# EAGLE design masterBoard (EAGLE 7.2.0)
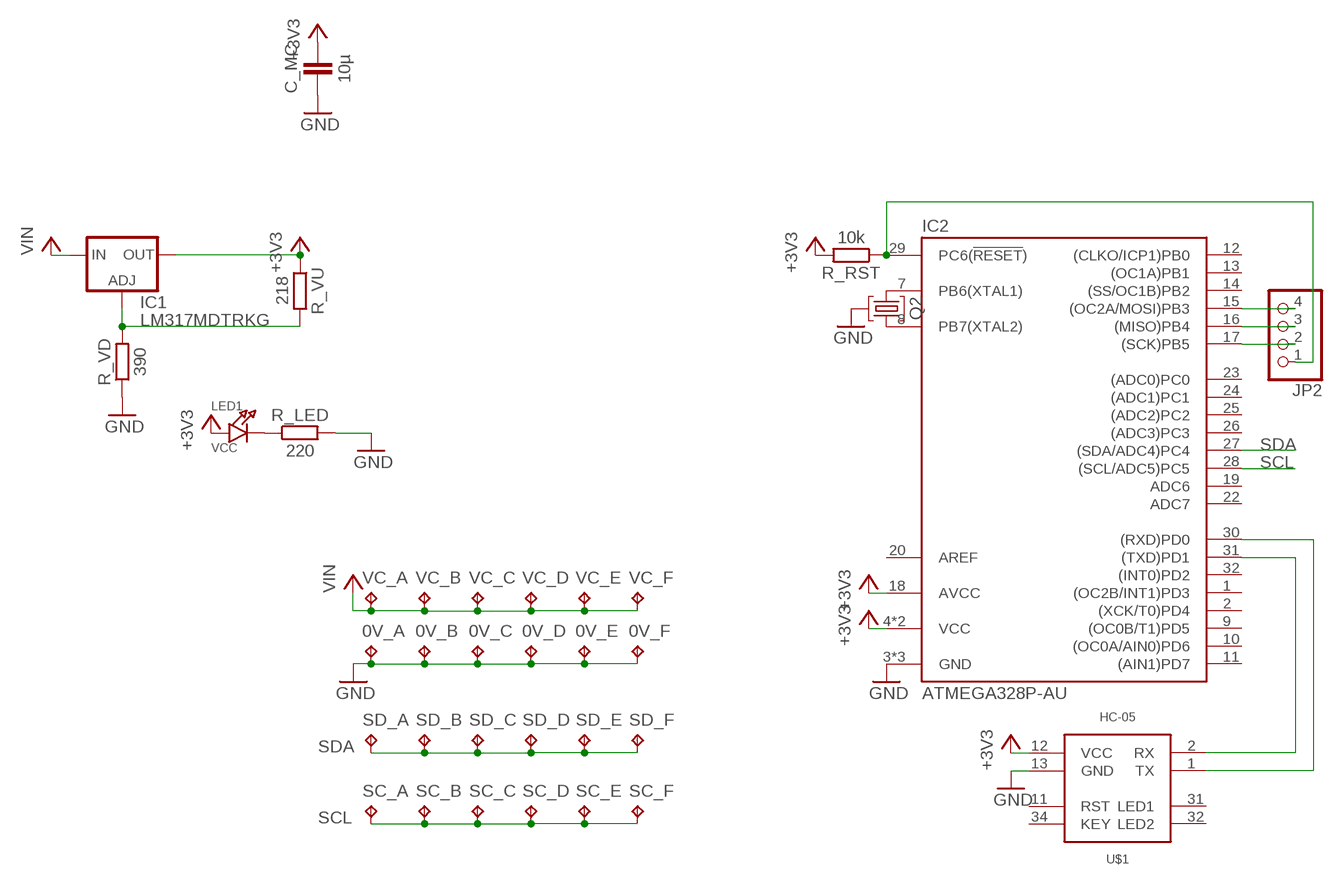
[diagram p0: schematic, sheet 1]

## Parts
0V_A  TPTP15SQ  [TP15SQ]
0V_B  TPTP15SQ  [TP15SQ]
0V_C  TPTP15SQ  [TP15SQ]
0V_D  TPTP15SQ  [TP15SQ]
0V_E  TPTP15SQ  [TP15SQ]
0V_F  TPTP15SQ  [TP15SQ]
C_MC  10µ  CAPACITOR  [603]
IC1  LM317MDTRKG  [DPACK]
IC2  ATMEGA328P-AU  [TQFP32]
JP2  PINHD-1X4  [1X04]
LED1  VCC  LED0805  [CHIPLED_0805]
Q2  CRYSTAL-RES-32  [CRYSTAL_32X13]
R_LED  220  RESISTOR0603  [603]
R_RST  10k  RESISTOR0603  [603]
R_VD  390  RESISTOR0603  [603]
R_VU  218  RESISTOR0603  [603]
SC_A  TPTP15SQ  [TP15SQ]
SC_B  TPTP15SQ  [TP15SQ]
SC_C  TPTP15SQ  [TP15SQ]
SC_D  TPTP15SQ  [TP15SQ]
SC_E  TPTP15SQ  [TP15SQ]
SC_F  TPTP15SQ  [TP15SQ]
SD_A  TPTP15SQ  [TP15SQ]
SD_B  TPTP15SQ  [TP15SQ]
SD_C  TPTP15SQ  [TP15SQ]
SD_D  TPTP15SQ  [TP15SQ]
SD_E  TPTP15SQ  [TP15SQ]
SD_F  TPTP15SQ  [TP15SQ]
U$1  HC-05  [HC-06]
VC_A  TPTP15SQ  [TP15SQ]
VC_B  TPTP15SQ  [TP15SQ]
VC_C  TPTP15SQ  [TP15SQ]
VC_D  TPTP15SQ  [TP15SQ]
VC_E  TPTP15SQ  [TP15SQ]
VC_F  TPTP15SQ  [TP15SQ]

## Nets
+3V3: C_MC.2 IC1.4(OUT) IC2.4(VCC) IC2.6(VCC) IC2.18(AVCC) LED1.A R_RST.2 R_VU.1 U$1.12(VCC)
GND: 0V_A.TP 0V_B.TP 0V_C.TP 0V_D.TP 0V_E.TP 0V_F.TP C_MC.1 IC2.3(GND) IC2.5(GND) IC2.21(GND) Q2.GND R_LED.2 R_VD.1 U$1.13(GND)
MISO: IC2.16((MISO)PB4) JP2.3
MOSI: IC2.15((OC2A/MOSI)PB3) JP2.4
N$1: LED1.C R_LED.1
N$2: IC2.29(PC6(!RESET!)) JP2.1 R_RST.1
N$3: IC2.30((RXD)PD0) U$1.1(TX)
N$4: IC2.31((TXD)PD1) U$1.2(RX)
N$9: IC2.7(PB6(XTAL1)) Q2.2
N$10: IC2.8(PB7(XTAL2)) Q2.1
N$18: IC1.1(ADJ) R_VD.2 R_VU.2
SCK: IC2.17((SCK)PB5) JP2.2
SCL: IC2.28((SCL/ADC5)PC5) SC_A.TP SC_B.TP SC_C.TP SC_D.TP SC_E.TP SC_F.TP
SDA: IC2.27((SDA/ADC4)PC4) SD_A.TP SD_B.TP SD_C.TP SD_D.TP SD_E.TP SD_F.TP
VCC: IC1.3(IN) VC_A.TP VC_B.TP VC_C.TP VC_D.TP VC_E.TP VC_F.TP ; supply symbol labelled VIN
Unconnected: IC2.1((OC2B/INT1)PD3) IC2.2((XCK/T0)PD4) IC2.9((OC0B/T1)PD5) IC2.10((OC0A/AIN0)PD6) IC2.11((AIN1)PD7) IC2.12((CLKO/ICP1)PB0) IC2.13((OC1A)PB1) IC2.14((SS/OC1B)PB2) IC2.19(ADC6) IC2.20(AREF) IC2.22(ADC7) IC2.23((ADC0)PC0) IC2.24((ADC1)PC1) IC2.25((ADC2)PC2) IC2.26((ADC3)PC3) IC2.32((INT0)PD2) U$1.11(RST) U$1.31(LED1) U$1.32(LED2) U$1.34(KEY)

## Library data of the parts
0V_A 0V_B 0V_C 0V_D 0V_E 0V_F SC_A SC_B SC_C SC_D SC_E SC_F SD_A SD_B SD_C SD_D SD_E SD_F VC_A VC_B VC_C VC_D VC_E VC_F = testpad:TP: Test pad
C_MC = thar:CAPACITOR
IC1 = v-reg:LM317?*: 500 mA Adjustable Output Positive Voltage Regulator Source: http://www.onsemi.co.jp .. LM317M-D.PDF
IC2 = we-chip:ATMEGA328P: Atmel ATmega48/88/168/328 AVR Microcontroller
JP2 = pinhead:PINHD-1X4: PIN HEADER
LED1 = microbuilder:LED: LED 0603 - 0603 Surface Mount Package 2mA: Green LED - Low Power (3.9mcd, 2ma, 1.7Vf) - Digikey: 475-2709-2-ND Orange LED - Low Power (9.8mcd, 2ma, 1.8Vf) - Digikey: 475-1194-2-ND Red LED - Low Power (5mcd, 2ma, 1.8Vf) - Digikey: 475-1195-2-ND Yellow LED - Low Power (7mcd, 2ma, 1.8Vf) - Digikey: 475-1196-2-ND 5mA: Blue LED - Low Power (17mcd, 5ma, 2.9Vf) - Digikey: LNJ937W8CRACT-ND 0805 - 0805 Surface Mount Package 2mA: Red LED (8.8mcd, 2mA, 1.8Vf, Clear) - Low Power [Digikey: 475-2510-1-ND] Green LED (5mcd, 2mA, 1.8Vf, Clear) - Low Power [Digikey: 475-2730-1-ND] Yellow LED (11.3mcd, 2mA, 1.8Vf, Clear) - Low Power [Digikey: 475-2555-1-ND] 20mA: Red LED (104mcd, 20mA, Diffused) - LS R976 [Digikey: 475-1278-6-ND] Red LED (12mcd, 20mA, 2.0Vf, Clear) - APT2012EC [Digikey: 754-1128-1-ND] Green LED (15mcd, 20mA, 2.2Vf, Clear) - APT2012GC [Digikey: 754-1131-1-ND] Orange LED (160mcd, 20mA, 2.1Vf, Clear) - APT2012SECK [Digikey: 754-1130-1-ND] 1206 - 1206 Surface Mount Package Green LED (26mcd, 20mA, Diffused) - LG N971 [Digikey: 475-1407-6-ND] Red LED (15mcd, 20mA, Diffused) - LH N974 [Digikey: 475-1416-6-ND]
Q2 = we-rcl:CRYSTAL-RES: Crystals Resonator
R_LED R_RST R_VD R_VU = thar:RESISTOR
U$1 = thar:HC-05: Wireless Bluetooth Transceiver Module HC-05 (Host-Slave integration) CP06001 Bezug: Ebay-Eckstein <http://stores.ebay.de/ecksteinkomponente/>

## Board
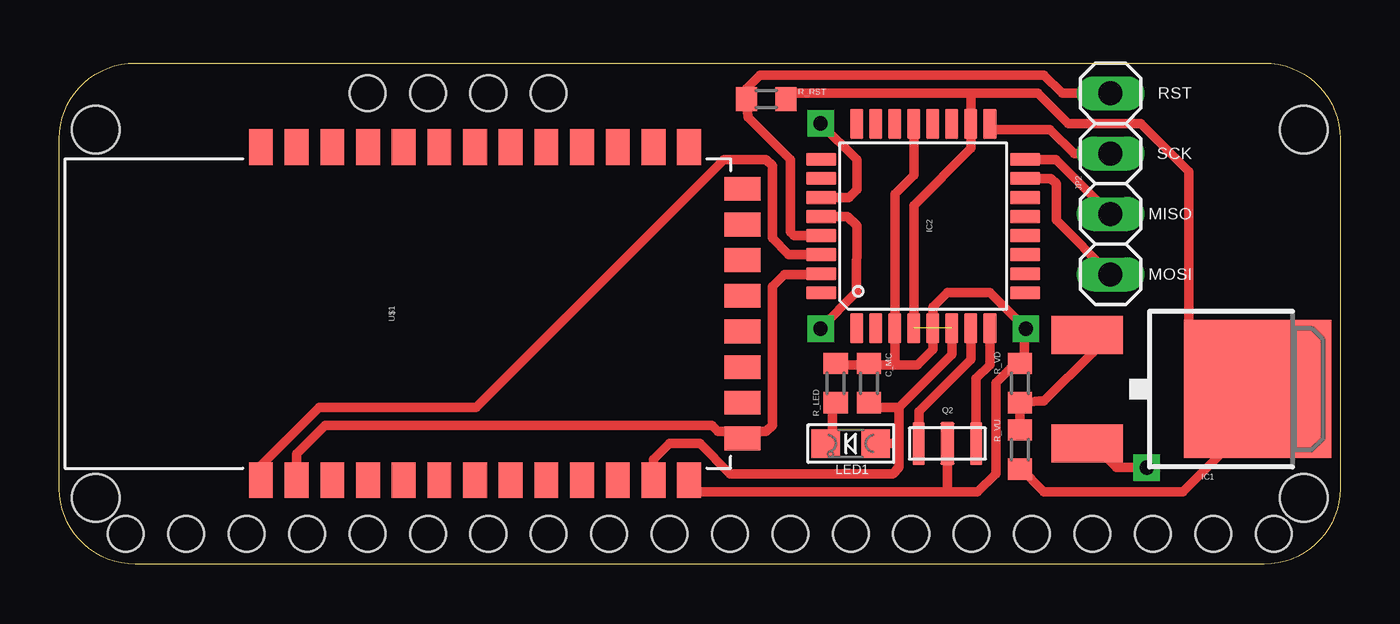
[diagram p1: board, top side]
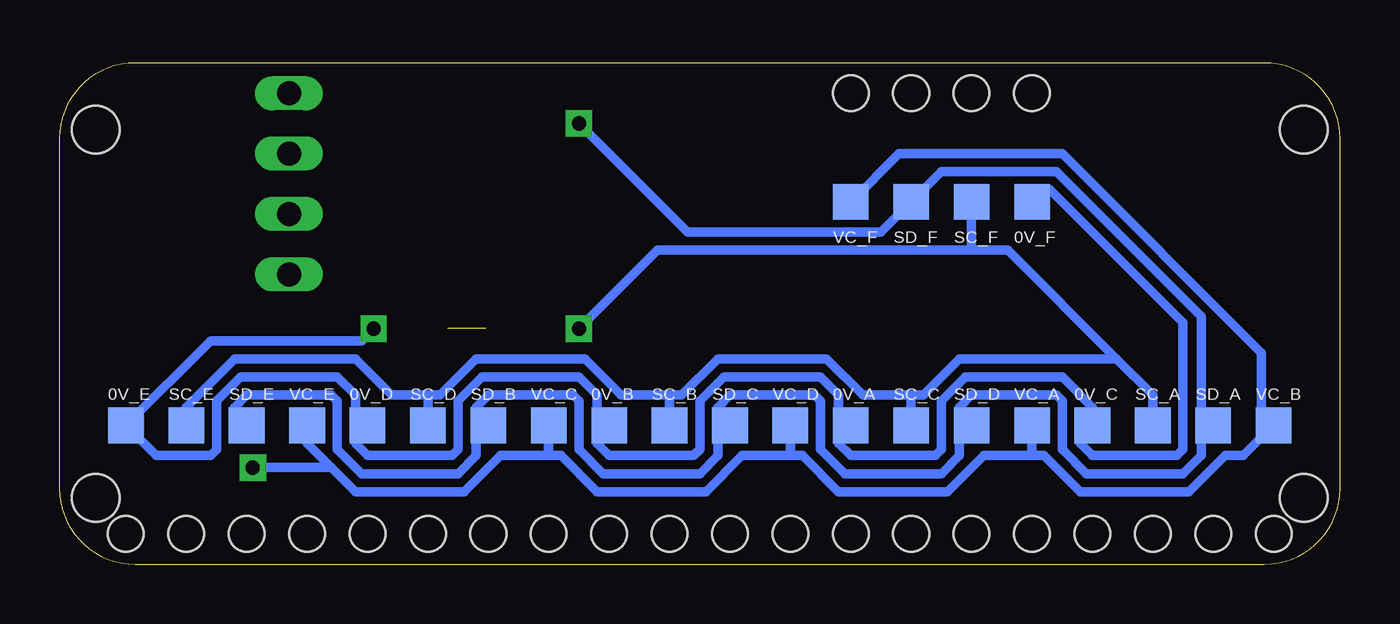
[diagram p2: board, bottom side, seen from below]

Size 53.85 x 21.08 mm. Coordinates in mm from the lower left corner, seen from the top.
Outline: 3.18,0 arc-90 0,3.18 0,17.91 arc-90 3.18,21.08 50.67,21.08 arc-90 53.85,17.91 53.85,3.18 arc-90 50.67,0 3.18,0
Copper layers (1*16): Top 0.035mm / dielectric 1.5mm / Bottom 0.035mm
Design rules "PCBCart-Standard *": minimum track width 8mil, minimum drill 0.4mm, track to track 8mil, track to pad 8mil, pad to pad 8mil, via to via 8mil, smd to smd 8mil, copper to edge 20mil, drill to drill 8mil, minimum pad ring 8mil, minimum via ring 10mil, stop-mask expansion 3mil, vias tented up to drill 20mil, thermal gap 8mil
Holes 2 mm at 1.52,18.29 52.32,18.29 52.32,2.79 1.52,2.79
Holes 1.5 mm at 7.87,1.27 10.41,1.27 12.95,1.27 15.49,1.27 18.03,1.27 20.57,1.27 45.97,1.27 43.43,1.27 40.89,1.27 38.35,1.27 35.81,1.27 33.27,1.27 30.73,1.27 28.19,1.27 25.65,1.27 23.11,1.27 5.33,1.27 2.79,1.27 48.51,1.27 51.05,1.27 20.57,19.81 18.03,19.81 15.49,19.81 12.95,19.81

### Footprints (pad centres in the part's own frame; a part is rotated, then mirrored left to right if it is on the bottom)
TP15SQ = smd 1.5 x 1.5: TP 0,0
603 = smd 0.889 x 1.016: 1 -0.826,0; 2 0.826,0
DPACK = smd 1.6 x 3: 1 -2.28,-4.8; 3 2.28,-4.8 | smd 5.8 x 6.2: 4 0,2.38
TQFP32 = smd 1.27 x 0.559: 1 -4.293,2.8; 2 -4.293,2; 3 -4.293,1.2; 4 -4.293,0.4; 5 -4.293,-0.4; 6 -4.293,-1.2; 7 -4.293,-2; 8 -4.293,-2.8; 17 4.293,-2.8; 18 4.293,-2; 19 4.293,-1.2; 20 4.293,-0.4; 21 4.293,0.4; 22 4.293,1.2; 23 4.293,2; 24 4.293,2.8 | smd 0.559 x 1.27: 9 -2.8,-4.293; 10 -2,-4.293; 11 -1.2,-4.293; 12 -0.4,-4.293; 13 0.4,-4.293; 14 1.2,-4.293; 15 2,-4.293; 16 2.8,-4.293; 25 2.8,4.293; 26 2,4.293; 27 1.2,4.293; 28 0.4,4.293; 29 -0.4,4.293; 30 -1.2,4.293; 31 -2,4.293; 32 -2.8,4.293
1X04 = drill 1.016 long: 1 -3.81,0; 2 -1.27,0; 3 1.27,0; 4 3.81,0
CHIPLED_0805 = smd 1.2 x 1.2: A 0,-1.05; C 0,1.05
CRYSTAL_32X13 = smd 1.8 x 0.5: 1 0,1.2; 2 0,-1.2 | smd 1.8 x 0.6: GND 0,0
HC-06 = smd 1.5 x 1: 1 -7,5.75; 2 -7,4.25; 3 -7,2.75; 4 -7,1.25; 5 -7,-0.25; 6 -7,-1.75; 7 -7,-3.25; 8 -7,-4.75; 9 -7,-6.25; 10 -7,-7.75; 11 -7,-9.25; 12 -7,-10.75; 13 -7,-12.25; 22 7,-12.25; 23 7,-10.75; 24 7,-9.25; 25 7,-7.75; 26 7,-6.25; 27 7,-4.75; 28 7,-3.25; 29 7,-1.75; 30 7,-0.25; 31 7,1.25; 32 7,2.75; 33 7,4.25; 34 7,5.75 | smd 1 x 1.5: 14 -5.25,-14.5; 15 -3.75,-14.5; 16 -2.25,-14.5; 17 -0.75,-14.5; 18 0.75,-14.5; 19 2.25,-14.5; 20 3.75,-14.5; 21 5.25,-14.5

### Placement (x,y rotation side)
0V_A  20.57,5.84 0 bottom
0V_B  30.73,5.84 0 bottom
0V_C  10.41,5.84 0 bottom
0V_D  40.89,5.84 0 bottom
0V_E  51.05,5.84 0 bottom
0V_F  12.95,15.24 0 bottom
C_MC  34.04,7.62 270 top
IC1  48.01,7.37 270 top
IC2  36.32,14.22 90 top
JP2  44.2,16 270 top
LED1  33.27,5.08 90 top
Q2  37.34,5.08 270 top
R_LED  32.64,7.62 90 top
R_RST  29.72,19.56 0 top
R_VD  40.39,7.62 270 top
R_VU  40.39,4.83 90 top
SC_A  7.87,5.84 0 bottom
SC_B  28.19,5.84 0 bottom
SC_C  18.03,5.84 0 bottom
SC_D  38.35,5.84 0 bottom
SC_E  48.51,5.84 0 bottom
SC_F  15.49,15.24 0 bottom
SD_A  5.33,5.84 0 bottom
SD_B  35.81,5.84 0 bottom
SD_C  25.65,5.84 0 bottom
SD_D  15.49,5.84 0 bottom
SD_E  45.97,5.84 0 bottom
SD_F  18.03,15.24 0 bottom
U$1  14.22,10.54 90 top
VC_A  12.95,5.84 0 bottom
VC_B  2.79,5.84 0 bottom
VC_C  33.27,5.84 0 bottom
VC_D  23.11,5.84 0 bottom
VC_E  43.43,5.84 0 bottom
VC_F  20.57,15.24 0 bottom

### Tracks (layer width: path | path; a pad name or v marks a point on that pad's centre or on a via)
+3V3  (1 unrouted)
  Top 0.406: IC1.4 50.55,7.37 49.78,6.6 | R_VU.1 40.39,4.06 41.4,3.05 47.24,3.05 49.78,5.59 49.78,6.6 | U$1.12 24.97,4.4 25.65,5.08 26.92,5.08 28.19,3.81 35.05,3.81 35.31,4.06 35.31,5.08 | IC2.6 37.52,8.82 35.31,6.6 | 49.78,6.6 49.78,7.87 49.53,8.13 49.53,9.4 49.02,9.91 47.5,9.91 47.5,16.51 45.47,18.54 42.42,18.54 41.15,19.81 38.35,19.81 | R_RST.2 30.54,19.81 38.35,19.81 | IC2.4 35.92,15.09 38.32,17.49 IC2.18 38.32,19.78 38.35,19.81 | C_MC.2 34.04,6.6 35.31,6.6 | 35.31,5.08 35.31,6.6 | LED1.A 35.31,5.08
GND  (via drill 0.6)
  Top 0.406: U$1.13 26.47,3.11 26.42,3.05 37.34,3.05 | Q2.GND 37.34,3.05 | IC2.21 35.92,16.36 35.12,15.56 IC2.3 35.12,8.38 | 40.58,8.38 40.13,8.38 39.37,7.62 39.37,3.81 38.61,3.05 37.34,3.05 | 40.58,8.38 R_VD.1 | 40.58,8.38 40.58,9.97 | 35.12,8.38 34.04,8.38 33.97,8.32 C_MC.1 33.72,8.38 32.77,8.38 32.58,8.45 R_LED.2 | 35.12,8.38 36.07,8.38 36.72,9.04 IC2.5 36.72,10.81 37.34,11.43 39.12,11.43 40.58,9.97 | v40.64,9.91 40.58,9.97
  Bottom 0.406: 21.08,5.84 21.08,7.11 21.84,7.87 25.91,7.87 26.92,6.86 26.92,4.83 27.18,4.57 30.73,4.57 31.24,5.08 31.24,5.59 30.99,5.84 0V_B.TP 31.24,5.84 31.24,7.11 32,7.87 36.07,7.87 37.08,6.86 37.08,4.83 37.34,4.57 40.89,4.57 41.4,5.08 41.4,5.84 | 0V_A.TP 21.08,5.84 | 21.08,5.84 21.08,5.08 20.57,4.57 17.02,4.57 16.76,4.83 16.76,6.86 15.75,7.87 11.68,7.87 10.41,6.6 0V_C.TP 10.92,5.84 10.92,5.08 10.41,4.57 6.86,4.57 6.6,4.83 6.6,10.16 12.19,15.75 0V_F.TP | 0V_D.TP 41.4,5.84 | 41.4,5.84 41.4,7.11 42.16,7.87 46.23,7.87 47.24,6.86 47.24,4.83 47.5,4.57 49.78,4.57 0V_E.TP 47.5,9.4 41.15,9.4 v40.64,9.91
MISO
  Top 0.406: IC2.16 41.9,17.02 JP2.3
MOSI
  Top 0.406: IC2.15 41.69,16.22 41.91,16 41.91,14.48 JP2.4
N$1
  Top 0.406: R_LED.1 32.64,6.73 32.51,6.6 32.51,5.5 LED1.C
N$2
  Top 0.406: IC2.29 30.88,13.82 30.73,13.97 30.73,17.02 28.96,18.8 R_RST.1 28.89,20 29.46,20.57 41.4,20.57 42.16,19.81 JP2.1
N$3
  Top 0.406: U$1.1 8.47,4.16 10.92,6.6 17.53,6.6 27.94,17.02 29.72,17.02 29.97,16.76 29.97,13.72 30.66,13.02 IC2.30
N$4
  Top 0.406: U$1.2 9.97,4.64 11.18,5.84 27.43,5.84 27.69,5.59 29.72,5.59 29.97,5.84 29.97,11.68 30.48,12.19 31.81,12.19 IC2.31
N$9
  Top 0.406: Q2.2 36.14,6.42 38.32,8.6 IC2.7
N$10
  Top 0.406: IC2.8 39.12,8.39 38.54,7.8 Q2.1
N$18
  Top 0.406: R_VU.2 R_VD.2 41.21,6.86 41.4,6.86 43.46,8.92 IC1.1
SCK
  Top 0.406: IC2.17 39.12,18.29 41.66,18.29 42.67,17.27 JP2.2
SCL  (via drill 0.6)
  Top 0.406: IC2.28 33.14,14.62 33.52,14.24 33.51,11.45 v32,9.91
  Bottom 0.406: 38.35,7.11 SC_D.TP | 9.4,8.64 7.87,7.11 SC_A.TP | v32,9.91 28.7,13.21 15.49,13.21 | 28.19,7.11 27.69,7.11 26.16,8.64 21.59,8.64 20.07,7.11 18.03,7.11 | 28.19,7.11 30.23,7.11 31.75,8.64 36.32,8.64 37.85,7.11 38.35,7.11 | SC_B.TP 28.19,7.11 | 9.4,8.64 16,8.64 17.53,7.11 18.03,7.11 | 18.03,7.11 SC_C.TP | SC_E.TP 48.51,6.6 46.48,8.64 41.4,8.64 39.88,7.11 38.35,7.11 | 15.49,13.21 SC_F.TP | 15.49,13.21 13.97,13.21 9.4,8.64
SDA  (via drill 0.6)
  Top 0.406: IC2.27 33.2,15.42 33.53,15.75 33.53,17.02 v32,18.54
  Bottom 0.406: 16,5.84 16,4.57 16.76,3.81 20.83,3.81 21.84,4.83 21.84,6.86 22.1,7.11 25.65,7.11 26.16,6.6 26.16,5.84 | 5.84,5.84 5.84,4.57 6.6,3.81 10.67,3.81 11.68,4.83 11.68,6.86 11.94,7.11 15.49,7.11 16,6.6 16,5.84 | 26.16,5.84 26.16,4.57 26.92,3.81 30.99,3.81 32,4.83 32,6.86 32.26,7.11 35.81,7.11 36.32,6.6 36.32,6.35 SD_B.TP 36.32,5.33 36.32,4.57 37.08,3.81 41.15,3.81 42.16,4.83 42.16,6.86 42.42,7.11 45.97,7.11 46.48,6.6 46.48,5.84 SD_E.TP | v32,18.54 27.43,13.97 19.3,13.97 SD_F.TP 16.76,16.51 11.94,16.51 5.84,10.41 5.84,5.84 | 26.16,5.84 SD_C.TP | 16,5.84 SD_D.TP | SD_A.TP 5.84,5.84
VCC  (via drill 0.6)
  Top 0.406: IC1.3 43.46,5.05 44.45,4.06 v45.72,4.06
  Bottom 0.406: 12.95,4.57 12.45,4.57 10.92,3.05 6.35,3.05 4.83,4.57 4.06,4.57 VC_B.TP 3.3,5.84 3.3,8.89 11.68,17.27 18.54,17.27 VC_F.TP | 12.95,4.57 14.99,4.57 16.51,3.05 21.08,3.05 22.61,4.57 23.11,4.57 | 23.11,4.57 25.15,4.57 26.67,3.05 31.24,3.05 32.77,4.57 33.27,4.57 | 33.27,4.57 VC_C.TP | VC_A.TP 12.95,4.57 | VC_D.TP 23.11,4.57 | 42.42,4.06 43.43,5.08 VC_E.TP | 33.27,4.57 35.31,4.57 36.83,3.05 41.4,3.05 42.42,4.06 | v45.72,4.06 42.42,4.06

### Text on the board
tPlace: RST | SCK | MISO | MOSI